# EAGLE design Ganganzeige_nutzen (EAGLE 6.5.0)

## Sheet 1 of 4
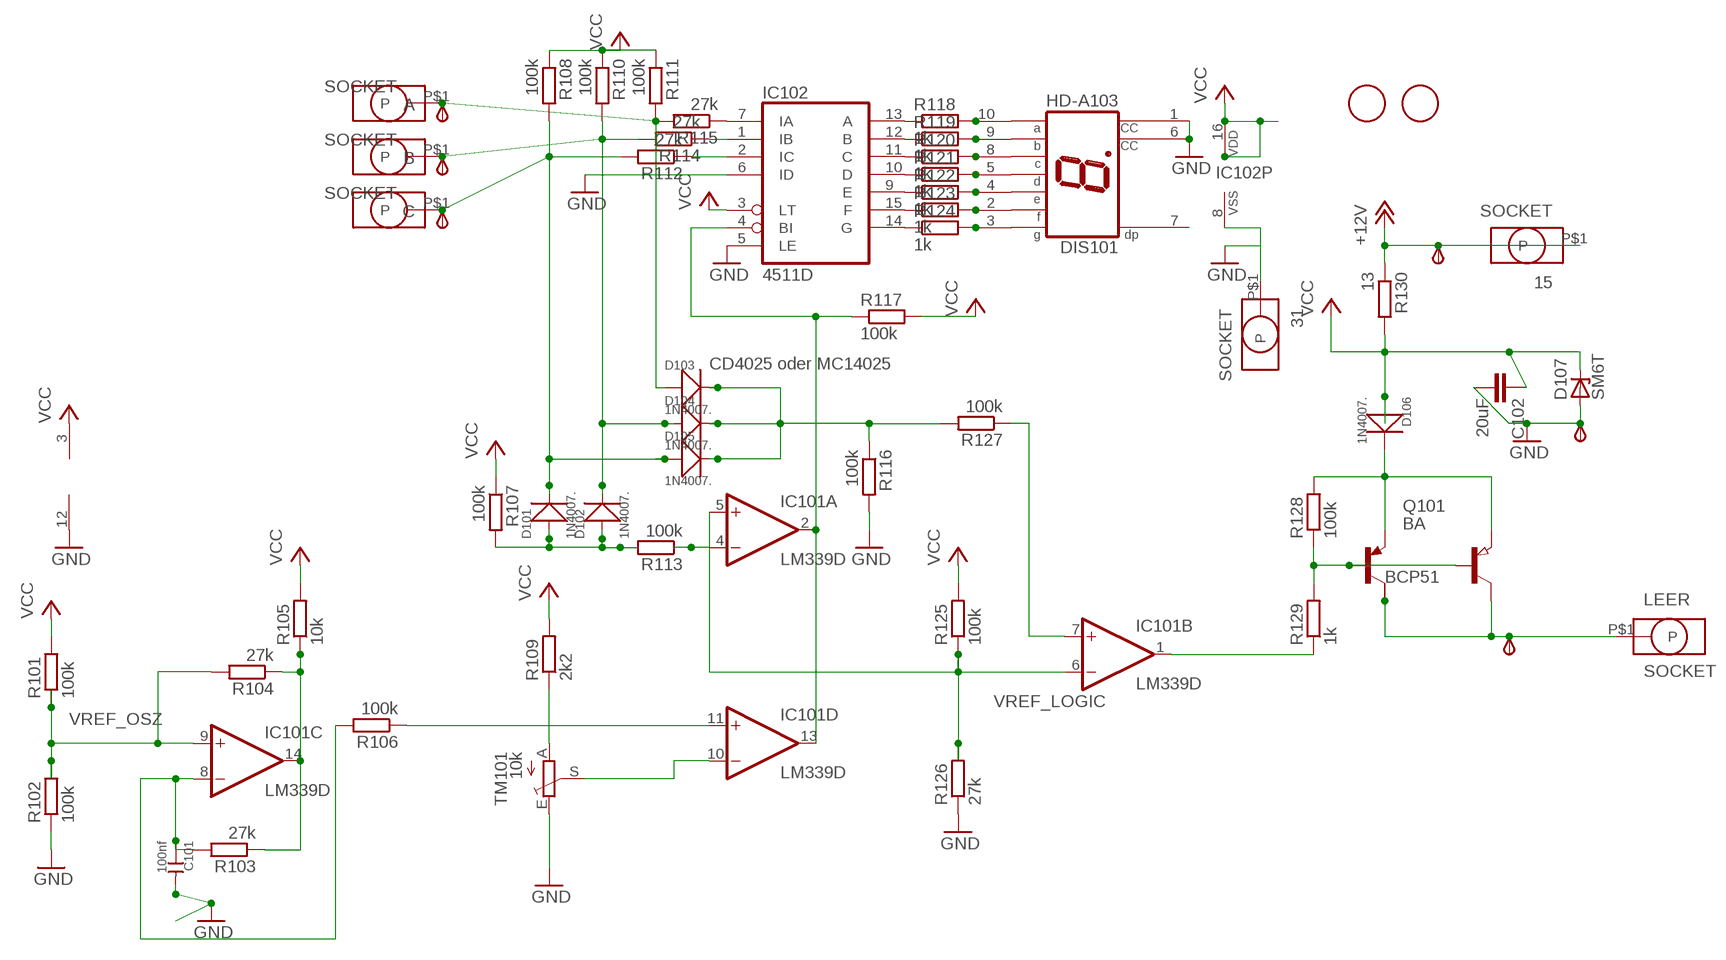
[diagram p0: schematic, sheet 1]

### Parts
15  SOCKET  [ID2.5MM]
15_  TPSB2.0  [B2.0]
31  SOCKET  [ID2.5MM]
A  SOCKET  [ID2.5MM]
A_  TPSB2.0  [B2.0]
B  SOCKET  [ID2.5MM]
B_  TPSB2.0  [B2.0]
C  SOCKET  [ID2.5MM]
C101  100nf  CERAMIC-100NF-50V-10%-X7R(0805)  [C0805]
C102  20uF  C-EUC1206K  [C1206K]
C_  TPSB2.0  [B2.0]
D101  1N4007.  DIODE-GEN-PURPOSE-1KV-1A(DO-214AC)  [DO-214AC]
D102  1N4007.  DIODE-GEN-PURPOSE-1KV-1A(DO-214AC)  [DO-214AC]
D103  1N4007.  DIODE-GEN-PURPOSE-1KV-1A(DO-214AC)  [DO-214AC]
D104  1N4007.  DIODE-GEN-PURPOSE-1KV-1A(DO-214AC)  [DO-214AC]
D105  1N4007.  DIODE-GEN-PURPOSE-1KV-1A(DO-214AC)  [DO-214AC]
D106  1N4007.  DIODE-GEN-PURPOSE-1KV-1A(DO-214AC)  [DO-214AC]
D107  SM6T  [DO214AA]
DIS101  HD-A103  [HDSP-A]
FID101  FIDUCIAL  [FIDUCIAL_1MM]
FID102  FIDUCIAL  [FIDUCIAL_1MM]
GND_  TPSB2.0  [B2.0]
IC101  LM339D  [SO14]
IC102  4511D  [SO16]
LEER  SOCKET  [ID2.5MM]
LEER_  TPSB2.0  [B2.0]
Q101  BA  PNP-TRANSISTOR_SOT89  [SOT89]
R101  100k  R-EU_R0805  [R0805]
R102  100k  R-EU_R0805  [R0805]
R103  27k  R-EU_R0805  [R0805]
R104  27k  R-EU_R0805  [R0805]
R105  10k  R-EU_R0805  [R0805]
R106  100k  R-EU_R0805  [R0805]
R107  100k  R-EU_R0805  [R0805]
R108  100k  R-EU_R0805  [R0805]
R109  2k2  R-EU_R0805  [R0805]
R110  100k  R-EU_R0805  [R0805]
R111  100k  R-EU_R0805  [R0805]
R112  27k  R-EU_R0805  [R0805]
R113  100k  R-EU_R0805  [R0805]
R114  27k  R-EU_R0805  [R0805]
R115  27k  R-EU_R0805  [R0805]
R116  100k  R-EU_R0805  [R0805]
R117  100k  R-EU_R0805  [R0805]
R118  1k  R-EU_R0805  [R0805]
R119  1k  R-EU_R0805  [R0805]
R120  1k  R-EU_R0805  [R0805]
R121  1k  R-EU_R0805  [R0805]
R122  1k  R-EU_R0805  [R0805]
R123  1k  R-EU_R0805  [R0805]
R124  1k  R-EU_R0805  [R0805]
R125  100k  R-EU_R0805  [R0805]
R126  27k  R-EU_R0805  [R0805]
R127  100k  R-EU_R0805  [R0805]
R128  100k  R-EU_R0805  [R0805]
R129  1k  R-EU_R0805  [R0805]
R130  13  R-EU_R1206  [R1206]
T  BCP53T1  [SOT223]
TM101  10k  TRIM_EU-S63X  [S63X]

### Nets
+12V: 15.P$1(P) 15_.TP(PP) R130.1 ; also sheet 2,3
GND: 31.P$1(P) C101.2 C102.2 D107.A DIS101.1(CC) DIS101.6(CC) GND_.TP(PP) IC101.12(P:GND) IC102.5(LE) IC102.6(ID) IC102.8(VSS) R102.1 R116.2 R126.1 TM101.E ; also sheet 2,3,4
N$1: IC102.13(A) R118.1
N$2: DIS101.10(A) R118.2
N$3: IC102.12(B) R119.1 ; also sheet 3
N$4: DIS101.9(B) R119.2
N$5: IC102.11(C) R120.1
N$6: DIS101.8(C) R120.2
N$7: IC102.10(D) R121.1
N$8: DIS101.5(D) R121.2
N$9: IC102.9(E) R122.1
N$10: R109.1 TM101.A
N$11: DIS101.4(E) R122.2
N$12: IC102.15(F) R123.1
N$13: DIS101.2(F) R123.2
N$14: IC102.14(G) R124.1
N$15: DIS101.3(G) R124.2
N$16: A.P$1(P) A_.TP(PP) D103.1(+) R111.2 R115.2
N$17: B.P$1(P) B_.TP(PP) D102.2(-) D104.1(+) R110.2 R114.2
N$18: C.P$1(P) C_.TP(PP) D101.2(-) D105.1(+) R108.2 R112.2
N$21: IC101.1(B:OUT) R129.1
N$22: Q101.1(B) R128.1 R129.2 T.1(B)
N$25: C101.1 IC101.8(C:-IN) R103.2 R106.2
N$26: IC101.14(C:OUT) R103.1 R104.1 R105.1
N$27: D101.1(+) D102.1(+) R107.2 R113.2
N$28: IC101.2(A:OUT) IC101.13(D:OUT) IC102.4(BI) R117.1
N$29: IC101.11(D:+IN) R106.1
N$30: IC101.10(D:-IN) TM101.S
N$32: IC101.7(B:+IN) R127.1
N$33: IC101.4(A:-IN) R113.1
N$34: IC102.7(IA) R115.1
N$35: D103.2(-) D104.2(-) D105.2(-) R116.1 R127.2
N$36: IC102.2(IC) R112.1
N$37: IC102.1(IB) R114.1
VCC [VCC]: C102.1 D106.1(+) D107.C IC101.3(P:V+) IC102.3(LT) IC102.16(VDD) R101.2 R105.2 R107.1 R108.1 R109.2 R110.1 R111.1 R117.2 R125.2 R130.2 ; also sheet 2,3
VREF_LOGIC: IC101.5(A:+IN) IC101.6(B:-IN) R125.1 R126.2 ; also sheet 2
VREF_OSZ: IC101.9(C:+IN) R101.1 R102.2 R104.2 ; also sheet 2
ZUEND_EIN [Zuendplus]: D106.2(-) Q101.3(E) R128.2 T.3(E)
ZUENDPLUS_OUT [Zuendplus]: LEER.P$1(P) LEER_.TP(PP) Q101.2(C) T.2(C)
Unconnected: DIS101.7(DP) T.4(C/)

### Notes on the sheet
- CD4025 oder MC14025

## Sheet 2 of 4
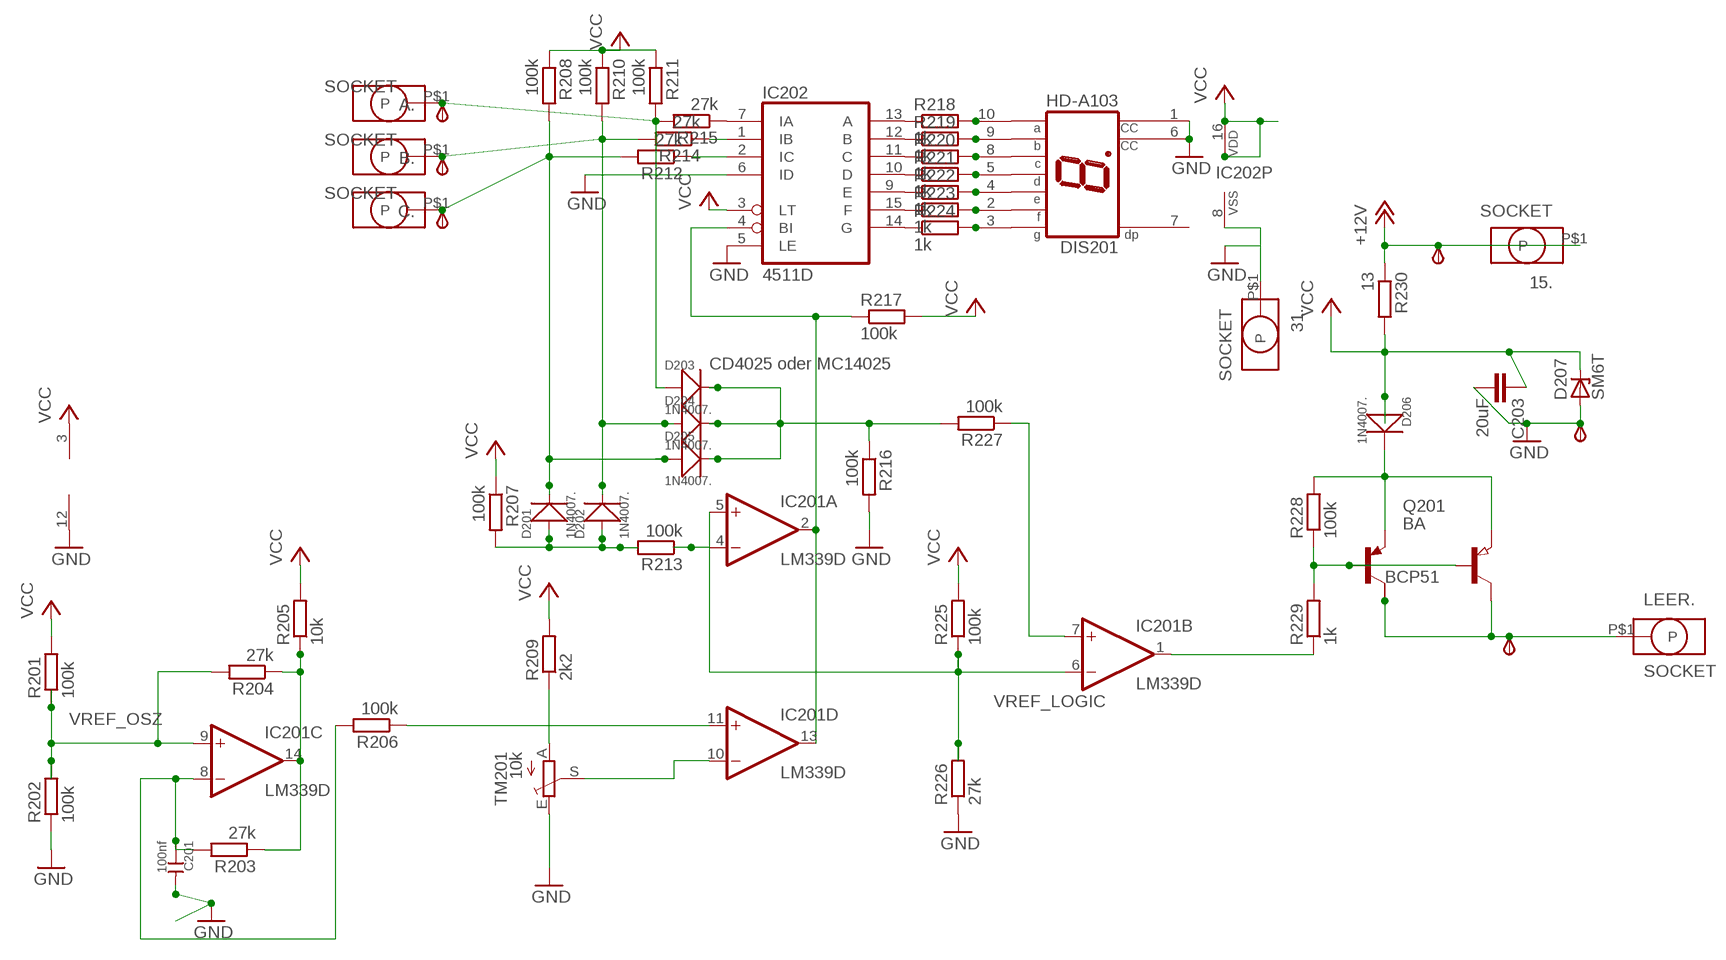
[diagram p1: schematic, sheet 2]

### Parts
15.  SOCKET  [ID2.5MM]
15_201  TPSB2.0  [B2.0]
31.  SOCKET  [ID2.5MM]
A.  SOCKET  [ID2.5MM]
A_201  TPSB2.0  [B2.0]
B.  SOCKET  [ID2.5MM]
B_201  TPSB2.0  [B2.0]
C201  100nf  CERAMIC-100NF-50V-10%-X7R(0805)  [C0805]
C203  20uF  C-EUC1206K  [C1206K]
C.  SOCKET  [ID2.5MM]
C_201  TPSB2.0  [B2.0]
D201  1N4007.  DIODE-GEN-PURPOSE-1KV-1A(DO-214AC)  [DO-214AC]
D202  1N4007.  DIODE-GEN-PURPOSE-1KV-1A(DO-214AC)  [DO-214AC]
D203  1N4007.  DIODE-GEN-PURPOSE-1KV-1A(DO-214AC)  [DO-214AC]
D204  1N4007.  DIODE-GEN-PURPOSE-1KV-1A(DO-214AC)  [DO-214AC]
D205  1N4007.  DIODE-GEN-PURPOSE-1KV-1A(DO-214AC)  [DO-214AC]
D206  1N4007.  DIODE-GEN-PURPOSE-1KV-1A(DO-214AC)  [DO-214AC]
D207  SM6T  [DO214AA]
DIS201  HD-A103  [HDSP-A]
GND_201  TPSB2.0  [B2.0]
IC201  LM339D  [SO14]
IC202  4511D  [SO16]
LEER.  SOCKET  [ID2.5MM]
LEER_201  TPSB2.0  [B2.0]
Q201  BA  PNP-TRANSISTOR_SOT89  [SOT89]
R201  100k  R-EU_R0805  [R0805]
R202  100k  R-EU_R0805  [R0805]
R203  27k  R-EU_R0805  [R0805]
R204  27k  R-EU_R0805  [R0805]
R205  10k  R-EU_R0805  [R0805]
R206  100k  R-EU_R0805  [R0805]
R207  100k  R-EU_R0805  [R0805]
R208  100k  R-EU_R0805  [R0805]
R209  2k2  R-EU_R0805  [R0805]
R210  100k  R-EU_R0805  [R0805]
R211  100k  R-EU_R0805  [R0805]
R212  27k  R-EU_R0805  [R0805]
R213  100k  R-EU_R0805  [R0805]
R214  27k  R-EU_R0805  [R0805]
R215  27k  R-EU_R0805  [R0805]
R216  100k  R-EU_R0805  [R0805]
R217  100k  R-EU_R0805  [R0805]
R218  1k  R-EU_R0805  [R0805]
R219  1k  R-EU_R0805  [R0805]
R220  1k  R-EU_R0805  [R0805]
R221  1k  R-EU_R0805  [R0805]
R222  1k  R-EU_R0805  [R0805]
R223  1k  R-EU_R0805  [R0805]
R224  1k  R-EU_R0805  [R0805]
R225  100k  R-EU_R0805  [R0805]
R226  27k  R-EU_R0805  [R0805]
R227  100k  R-EU_R0805  [R0805]
R228  100k  R-EU_R0805  [R0805]
R229  1k  R-EU_R0805  [R0805]
R230  13  R-EU_R1206  [R1206]
T201  BCP53T1  [SOT223]
TM201  10k  TRIM_EU-S63X  [S63X]

### Nets
+12V: 15..P$1(P) 15_201.TP(PP) R230.1 ; also sheet 1,3
GND: 31..P$1(P) C201.2 C203.2 D207.A DIS201.1(CC) DIS201.6(CC) GND_201.TP(PP) IC201.12(P:GND) IC202.5(LE) IC202.6(ID) IC202.8(VSS) R202.1 R216.2 R226.1 TM201.E ; also sheet 1,3,4
N$19: IC202.13(A) R218.1
N$23: DIS201.10(A) R218.2
N$24: IC202.12(B) R219.1
N$31: DIS201.9(B) R219.2
N$38: IC202.11(C) R220.1
N$39: DIS201.8(C) R220.2
N$40: IC202.10(D) R221.1
N$41: DIS201.5(D) R221.2
N$42: IC202.9(E) R222.1
N$43: DIS201.4(E) R222.2
N$44: IC202.15(F) R223.1
N$45: DIS201.2(F) R223.2
N$46: IC202.14(G) R224.1
N$47: DIS201.3(G) R224.2
N$48: A..P$1(P) A_201.TP(PP) D203.1(+) R211.2 R215.2
N$49: B..P$1(P) B_201.TP(PP) D202.2(-) D204.1(+) R210.2 R214.2
N$50: C..P$1(P) C_201.TP(PP) D201.2(-) D205.1(+) R208.2 R212.2
N$52: IC201.1(B:OUT) R229.1
N$53: Q201.1(B) R228.1 R229.2 T201.1(B)
N$54: D201.1(+) D202.1(+) R207.2 R213.2
N$55: IC201.2(A:OUT) IC201.13(D:OUT) IC202.4(BI) R217.1
N$56: D203.2(-) D204.2(-) D205.2(-) R216.1 R227.2
N$57: C201.1 IC201.8(C:-IN) R203.2 R206.2
N$58: IC201.14(C:OUT) R203.1 R204.1 R205.1
N$59: IC201.10(D:-IN) TM201.S
N$60: IC201.11(D:+IN) R206.1
N$61: IC201.7(B:+IN) R227.1
N$62: IC201.4(A:-IN) R213.1
N$63: IC202.7(IA) R215.1
N$64: IC202.2(IC) R212.1
N$65: IC202.1(IB) R214.1
N$66: R209.1 TM201.A
VCC [VCC]: C203.1 D206.1(+) D207.C IC201.3(P:V+) IC202.3(LT) IC202.16(VDD) R201.2 R205.2 R207.1 R208.1 R209.2 R210.1 R211.1 R217.2 R225.2 R230.2 ; also sheet 1,3
VREF_LOGIC: IC201.5(A:+IN) IC201.6(B:-IN) R225.1 R226.2 ; also sheet 1
VREF_OSZ: IC201.9(C:+IN) R201.1 R202.2 R204.2 ; also sheet 1
ZUEND_EIN1 [Zuendplus]: D206.2(-) Q201.3(E) R228.2 T201.3(E)
ZUENDPLUS_OUT1 [Zuendplus]: LEER..P$1(P) LEER_201.TP(PP) Q201.2(C) T201.2(C)
Unconnected: DIS201.7(DP) T201.4(C/)

### Notes on the sheet
- CD4025 oder MC14025

## Sheet 3 of 4
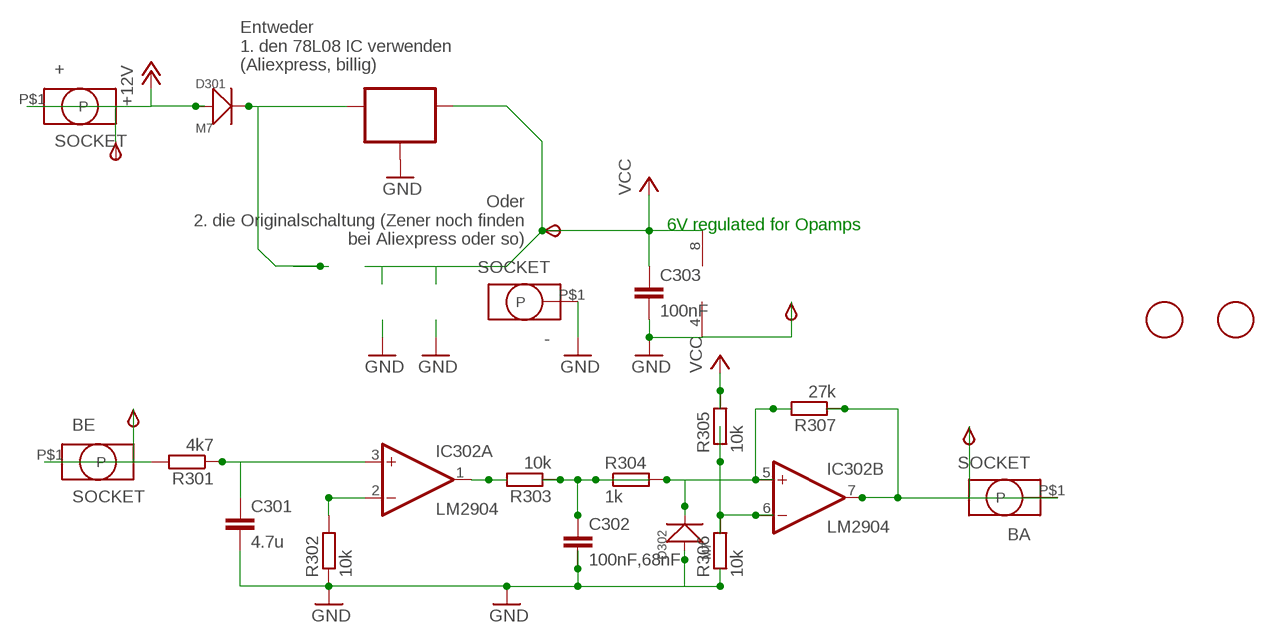
[diagram p2: schematic, sheet 3]

### Parts
6V  TPSB2.0  [B2.0]
+  SOCKET  [ID2.5MM]
+12V  TPSB2.0  [B2.0]
-  SOCKET  [ID2.5MM]
AUS  TPSB2.0  [B2.0]
BA  SOCKET  [ID2.5MM]
BE  SOCKET  [ID2.5MM]
C301  4.7u  C-EUC0805K  [C0805K]
C302  100nF,68nF  C-EUC0805K  [C0805K]
C303  100nF  C-EUC0805K  [C0805K]
D301  M7  DIODE-GEN-PURPOSE-1KV-1A(DO-214AC)  [DO-214AC]
D302  M7  DIODE-GEN-PURPOSE-1KV-1A(DO-214AC)  [DO-214AC]
EIN  TPSB2.0  [B2.0]
FID301  FIDUCIAL  [FIDUCIAL_1MM]
FID302  FIDUCIAL  [FIDUCIAL_1MM]
GND  TPSB2.0  [B2.0]
IC301  5V/6V oder 8V Regler  78LXXSOT89_ROUND  [SOT89_ROUND]
IC302  LM2904  LM358D  [SO08]
R301  4k7  R-EU_R0805  [R0805]
R302  10k  R-EU_R0805  [R0805]
R303  10k  R-EU_R0805  [R0805]
R304  1k  R-EU_R0805  [R0805]
R305  10k  R-EU_R0805  [R0805]
R306  10k  R-EU_R0805  [R0805]
R307  27k  R-EU_R0805  [R0805]

### Nets
+12V: +12V.TP(PP) +.P$1(P) D301.1(+) ; also sheet 1,2
+12V1: AUS.TP(PP) BA.P$1(P) IC302.7(B:OUT) R307.1
GND: -.P$1(P) C301.2 C302.2 C303.2 D302.1(+) GND.TP(PP) IC301.2(GND) IC301.2@1(GND) IC302.4(P:V-) R302.1 R306.1 ; also sheet 1,2,4
N$67: IC302.2(A:-IN) R302.2
N$68: BE.P$1(P) EIN.TP(PP) R301.2
N$69: C301.1 IC302.3(A:+IN) R301.1
N$70: D301.2(-) IC301.3(IN)
N$92: IC302.1(A:OUT) R303.2
N$96: C302.1 R303.1 R304.1
N$97: D302.2(-) IC302.5(B:+IN) R304.2 R307.2
N$101: IC302.6(B:-IN) R305.1 R306.2
VCC [VCC]: 6V.TP(PP) C303.1 IC301.1(OUT) IC302.8(P:V+) R305.2 ; also sheet 1,2

### Notes on the sheet
- Entweder
  1. den 78L08 IC verwenden 
  (Aliexpress, billig)
- Oder
  2. die Originalschaltung (Zener noch finden
  bei Aliexpress oder so)
- 6V regulated for Opamps

## Sheet 4 of 4
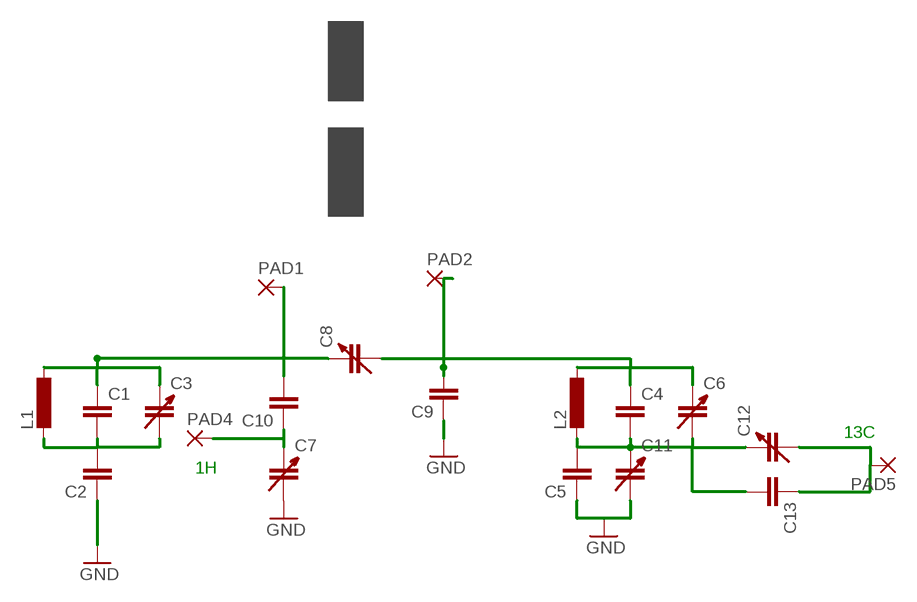
[diagram p3: schematic, sheet 4]

### Parts
C1  C-EUC055X055_HIGH_DENSITY  [C055X055_HD]
C2  C-EUC055X055_HIGH_DENSITY  [C055X055_HD]
C3  CTRIM-EUVOLTRONICS_JZ_SERIES  [VOLTRONICS_JZ]
C4  C-EUC055X055_HIGH_DENSITY  [C055X055_HD]
C5  C-EUC055X055_HIGH_DENSITY  [C055X055_HD]
C6  CTRIM-EUVOLTRONICS_JZ_SERIES  [VOLTRONICS_JZ]
C7  CTRIM-EUVOLTRONICS_JZ_SERIES  [VOLTRONICS_JZ]
C8  CTRIM-EUVOLTRONICS_JZ_SERIES  [VOLTRONICS_JZ]
C9  C-EUC055X055_HIGH_DENSITY  [C055X055_HD]
C10  C-EUC055X055_HIGH_DENSITY  [C055X055_HD]
C11  CTRIM-EUVOLTRONICS_JZ_SERIES  [VOLTRONICS_JZ]
C12  CTRIM-EUVOLTRONICS_JZ_SERIES  [VOLTRONICS_JZ]
C13  C-EUC055X055_HIGH_DENSITY  [C055X055_HD]
L1  L-EU6WDG_0.5MM_SELFWOUND_COIL  [6WDG_0.5MM]
L2  L-EU6WDG_0.5MM_SELFWOUND_COIL  [6WDG_0.5MM]
PAD1  SMD2  [SMD1,27-2,54]
PAD2  SMD2  [SMD1,27-2,54]
PAD4  1,6/0,9  [1,6/0,9]
PAD5  1,6/0,9  [1,6/0,9]

### Nets
GND: C2.1 C5.1 C7.2 C9.1 C11.2 ; also sheet 1,2,3
N$76: C1.2 C2.2 C3.2 L1.2
N$77: C4.2 C5.2 C6.2 C11.1 C12.1 C13.2 L2.2
N$78: C4.1 C6.1 C8.2 C9.2 L2.1 PAD2.1(P)
N$79: C7.1 C10.1 PAD4.1(P)
N$80: C1.1 C3.1 C8.1 C10.2 L1.1 PAD1.1(P)
N$81: C12.2 C13.1 PAD5.1(P)

### Notes on the sheet
- 13C
- 1H

## Library data of the parts
6V 15_ 15_201 +12V A_ A_201 AUS B_ B_201 C_ C_201 EIN GND GND_ GND_201 LEER_ LEER_201 = testpin_BMW:TPS: TEST PIN
15 15. 31 31. + - A A. B B. BA BE C C. LEER LEER. = Brotbox_Socket_Header:SOCKET
C1 C2 C4 C5 C9 C10 C13 = F80_project_library:C-EU: CAPACITOR, European symbol
C3 C6-C8 C11 C12 = F80_project_library:CTRIM-EU: Trimmer Capacitors
C101 C201 = Seeed-Capacitor-2016:CERAMIC-100NF-50V-10%-X7R(0805): 302010165; MPN: CC0805KRX7R9BB104
C102 C203 C301-C303 = rcl:C-EU: CAPACITOR, European symbol
D101-D106 D201-D206 D301 D302 = Diode-do214ac:DIODE-GEN-PURPOSE-1KV-1A(DO-214AC): 304010013; MPN: 1N4007; VALUE: 1N4007
D107 D207 = Suppressor_Diode_DO214AA:SM6T: Z DIODE
DIS101 DIS201 = display-hp:HD-A103: LED DISPLAY 1-character 7 segment, decimal point right; OC_FARNELL: unknown; OC_NEWARK: unknown
FID101 FID102 FID301 FID302 = Fiducial:FIDUCIAL: For use by pick and place machines to calibrate the vision/machine, 1mm By microbuilder.eu
IC101 IC201 = LM339:LM339: Low Power Low Offset Voltage Quad Comparators with open collector; LM139/LM239/LM339/LM2901/LM3302
IC102 IC202 = 45xx:4511: BCD to 7-segment LATCH/DECODER/DRIVER
IC301 = 78LXX:78LXX
IC302 = linear_BMW:LM358: OP AMP also LM158; LM258; LM2904 Source: http://cache.national.com/ds/LM/LM158.pdf
L1 L2 = F80_project_library:L-EU: INDUCTOR, European symbol
PAD1 PAD2 = wirepad:SMD2: SMD PAD
PAD4 PAD5 = wirepad:1,6/0,9: THROUGH-HOLE PAD
Q101 Q201 = Transistor_SOT89:PNP-TRANSISTOR_: PNP TRANSISTOR
R101-R130 R201-R230 R301-R307 = rcl:R-EU_: RESISTOR, European symbol
T T201 = BCP53_:BCP53*; T: BCP51
TM101 TM201 = pot:TRIM_EU-: POTENTIOMETER

## Net classes
1 VCC: width 0.6 mm
2 Zuendplus: width 1 mm, drill 0.6 mm

## Board
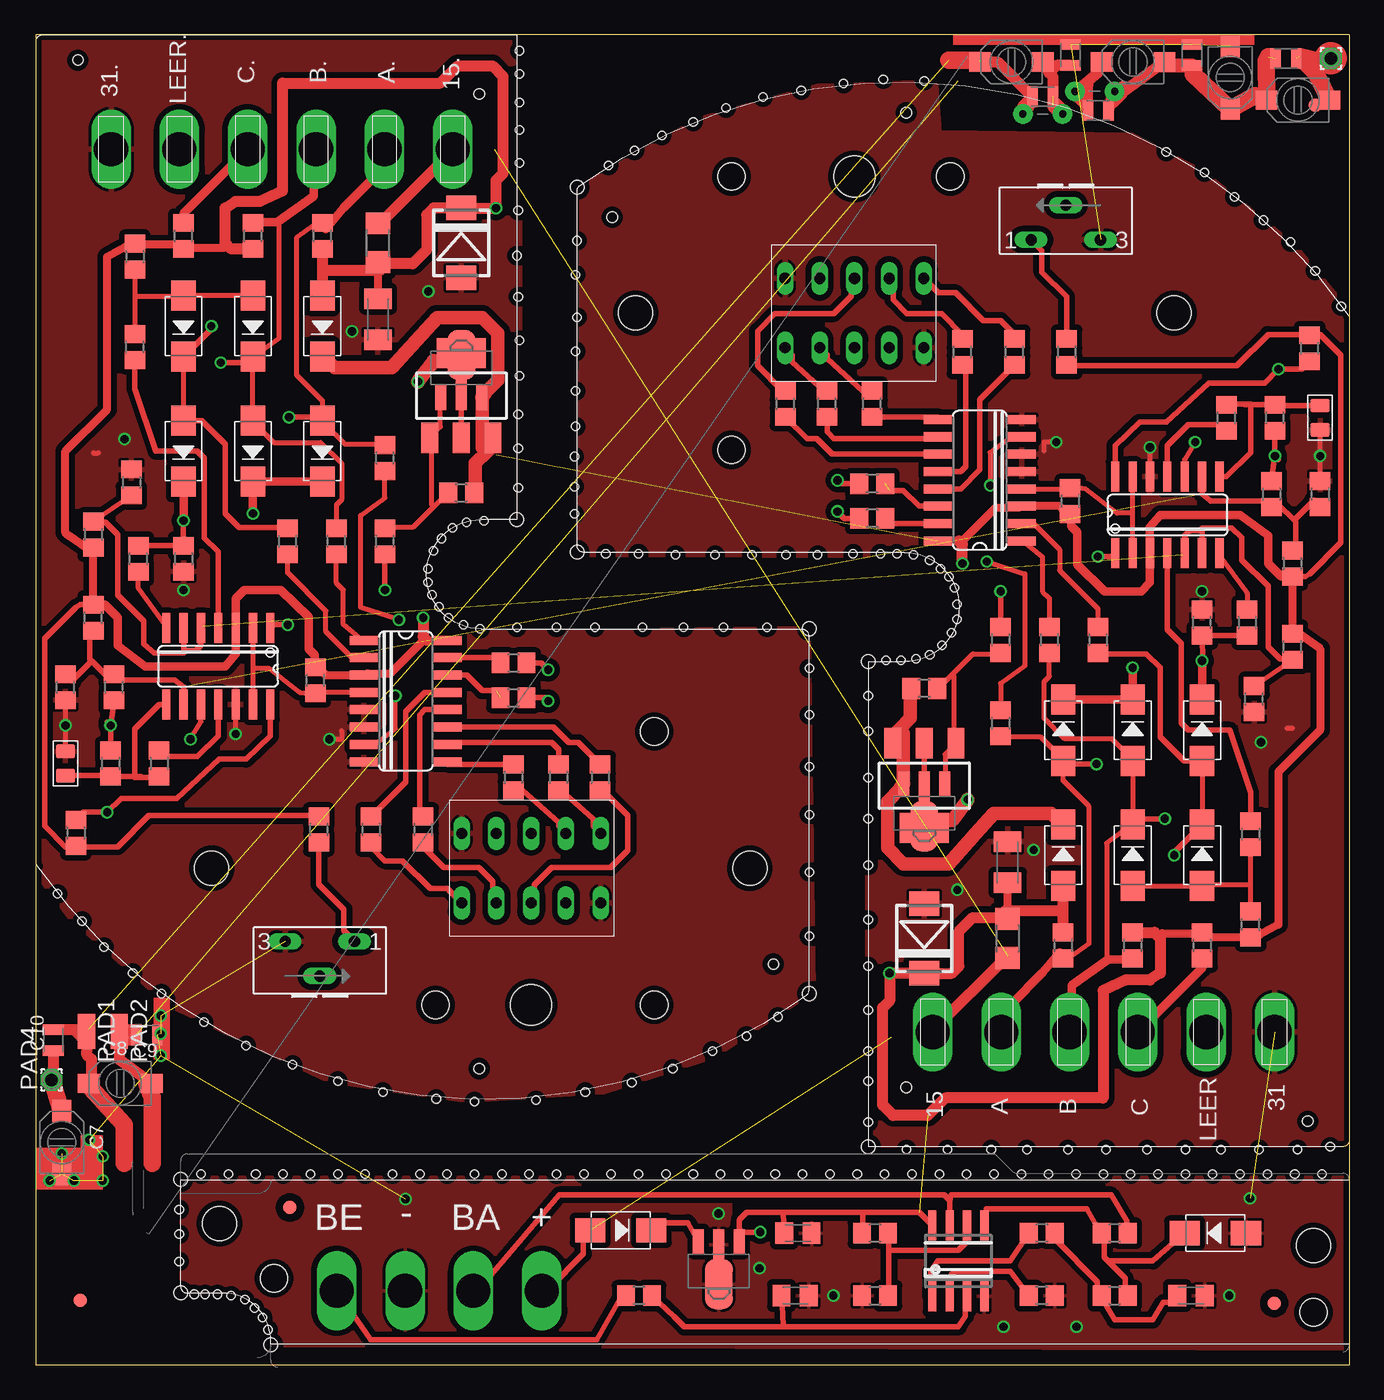
[diagram p4: board, top side]
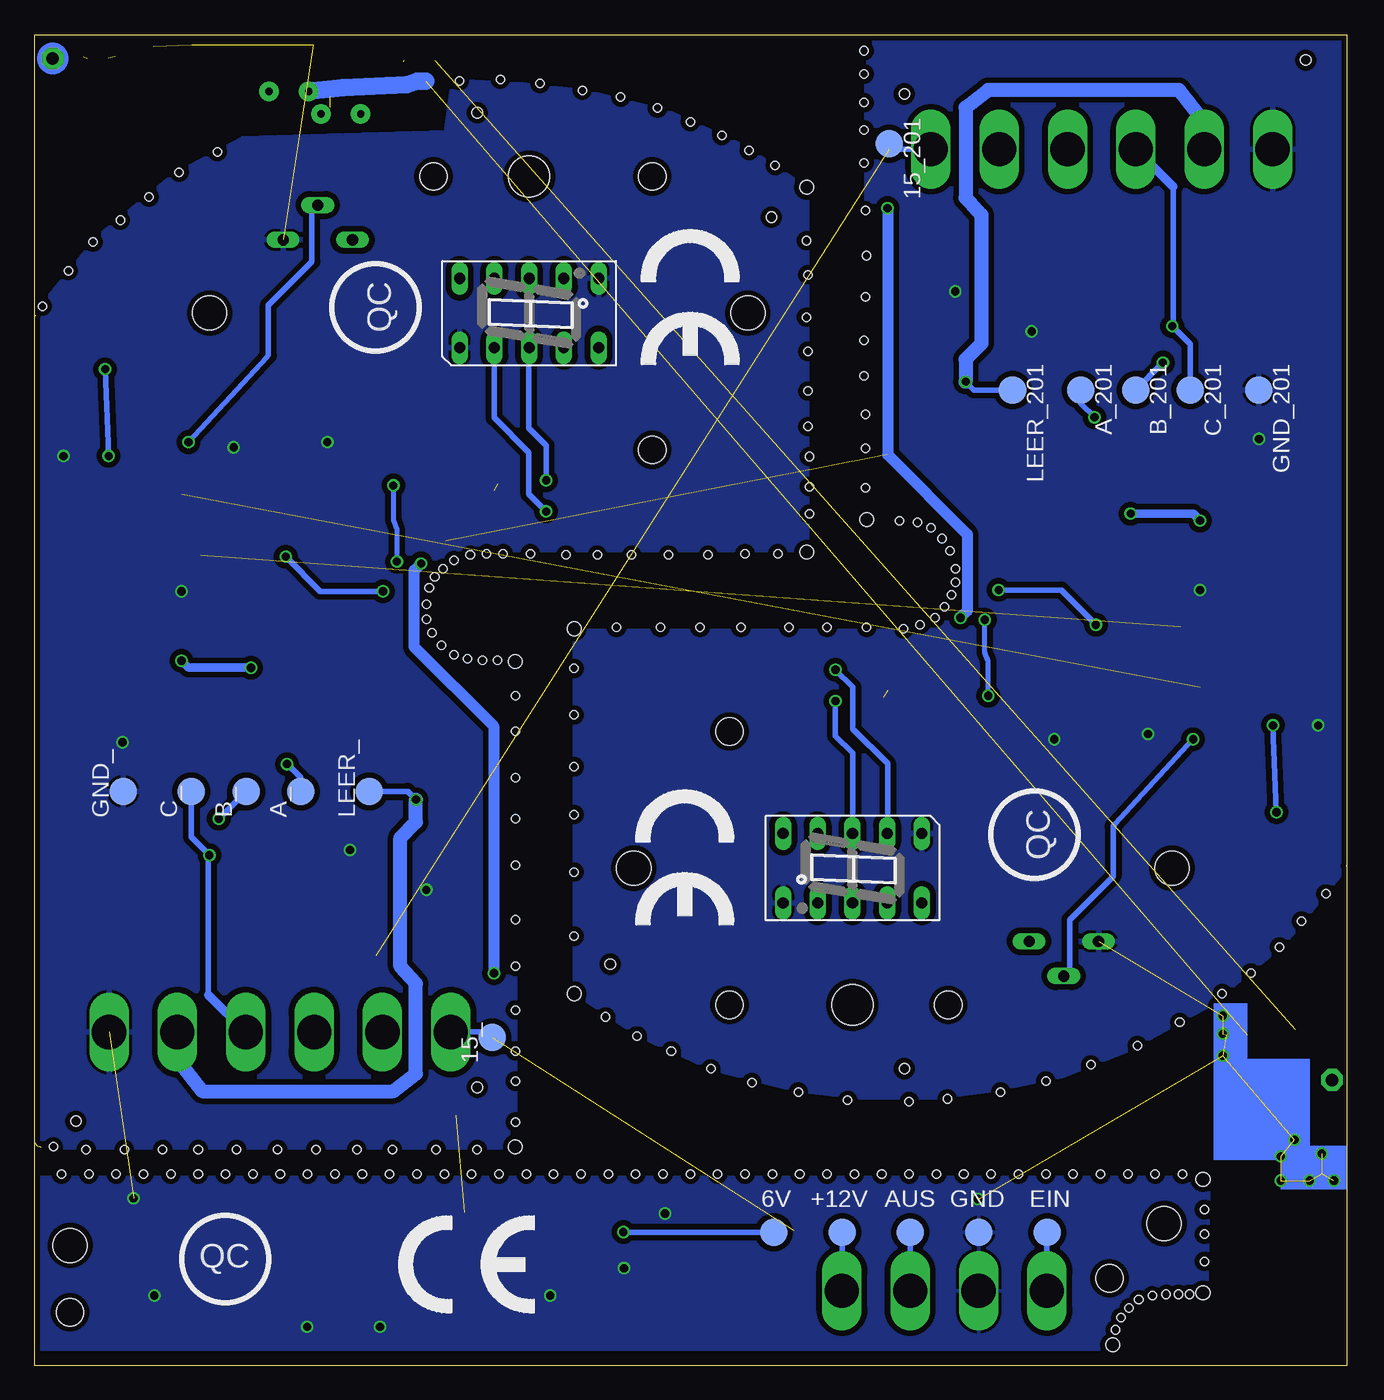
[diagram p5: board, bottom side, seen from below]

Size 96.06 x 97.38 mm. Coordinates in mm from the lower left corner, seen from the top.
Outline: 95.97,76.85 arc-35 96.06,76.56
Outline: 96.06,16.5 96.06,97.38 0,97.38 0,0 96.06,0 96.06,16.5
Outline: 96.06,16.5 arc-90 95.56,16
Outline: 0.09,36.53 arc-35 0,36.81
Outline: 96.06,13.56 96.06,1.55
Copper layers (1*16): Top 0.035mm / dielectric 1.5mm / Bottom 0.035mm
Design rules "Ganganzeige2b *": minimum track width 15mil, minimum drill 12mil, track to track 0.41mm, track to pad 12mil, pad to pad 0.205mm, via to via 0.205mm, smd to smd 6mil, copper to edge 0.4mm, drill to drill 8mil, minimum pad ring 8mil, minimum via ring 6mil, stop-mask expansion 3mil, vias tented up to drill 0mil, thermal gap 8mil
Holes 0.75 mm at 63.65,91.66 42.14,84.02 93.02,17.86 63.65,20.34 32.41,21.72 53.93,29.36 3.05,95.51 32.41,93.04
Holes 2.5 mm at 43.86,77 83.23,77 52.21,36.38 12.84,36.38 13.41,10.38 93.44,8.78
Holes 3 mm at 59.86,87 36.21,26.38
Holes 2 mm at 50.86,87 66.86,87 50.86,67 45.21,26.38 29.21,26.38 45.21,46.38 17.4,6.37 93.44,3.88
Holes 1 mm at 35.16,61.9 60.86,51.5 56.56,53.9 39.56,59.5 10.56,13.6 17.16,1.5 10.56,5.3 60.86,16 56.56,27.2 39.56,86.2
Holes 0.6 mm at 32.76,61.8 31.46,61.7 30.46,61.3 29.66,60.5 29.06,59.6 28.66,58.3 28.66,57.3 28.96,56.4 29.46,55.5 30.16,54.7 31.26,54.2 32.46,53.9 62.16,51.6 63.26,51.6 64.36,51.7 65.36,52 66.26,52.7 66.96,53.6 67.36,54.6 67.36,55.7 67.16,56.9 66.76,57.7 66.16,58.3 65.36,58.9 64.16,59.3 62.96,59.4 16.96,2.6 16.56,3.5 15.96,4.2 15.26,4.8 14.26,5.1 13.26,5.2 12.36,5.2 11.56,5.2 32.06,19.3 36.56,19.4 40.16,20 43.56,20.7 46.56,21.7 49.46,23 51.96,24.1 54.26,25.5 29.26,19.5 25.36,20 22.06,20.8 18.76,22 15.36,23.4 12.26,25.1 9.16,27.2 7.06,28.7 4.96,30.6 3.36,32.5 1.56,34.5 56.56,31.4 56.56,36.1 56.56,40.3 56.56,43.8 56.56,47.6 56.56,51 53.46,54 50.26,54 47.36,54 44.36,54 40.86,54 38.06,54 35.16,54 41.86,87.8 43.76,88.9 45.76,90 48.06,91 50.46,92 53.16,92.8 55.96,93.3 59.06,93.8 61.96,94.1 64.96,94 82.66,88.8 85.46,87.3 87.66,85.5 89.76,83.8 91.76,82.2 93.56,80.1 95.46,77.5 39.56,82.3 35.36,88 35.26,84.5 35.16,81.2 35.26,78.2 35.36,75 39.46,79.8 39.56,76.7 39.46,74.2 39.46,71.3 39.46,68.7 39.36,66.5 39.36,64.3 39.36,62.3 35.26,64.2 35.26,67.1 35.26,69.6 35.36,72.4 41.66,59.4 44.06,59.4 46.76,59.3 49.66,59.3 52.36,59.3 54.86,59.3 57.16,59.3 59.76,59.4 61.76,59.4 35.36,90.4 35.36,92.4 35.36,94.5 35.36,96.2 60.86,49 60.86,46.4 60.86,43 60.86,40 60.86,36.6 60.86,32.6 60.86,29.2 60.86,26 60.86,23 60.86,20.8 60.86,17.8 63.66,15.8 66.66,15.8 69.86,15.8 72.46,15.8 75.46,15.8 78.26,15.8 81.26,15.8 84.06,15.8 86.66,15.8 89.46,15.8 92.26,15.8 94.66,16 10.46,11.4 10.46,9.6 10.46,7.6 94.06,14 92.06,14 90.06,14 88.06,14 86.06,14 84.06,14 82.06,14 80.06,14 78.06,14 76.06,14 74.06,14 72.06,14 70.06,14 68.06,14 66.06,14 64.06,14 62.06,14 60.06,14 58.06,14 56.06,14 54.06,14 52.06,14 50.06,14 48.06,14 46.06,14 44.06,14 42.06,14 40.06,14 38.06,14 36.06,14 34.06,14 32.06,14 30.06,14 28.06,14 26.06,14 24.06,14 22.06,14 20.06,14 18.06,14 16.06,14 14.06,14 12.06,14
tRestrict: area 51,11.2 to 66.4,12

### Footprints (pad centres in the part's own frame; a part is rotated, then mirrored left to right if it is on the bottom)
B2.0 = smd 2 x 2: TP 0,0
ID2.5MM = drill 2.5 long: P$1 0,0
C055X055_HD = smd 0.762 x 1.524: 1 -0.762,0; 2 0.762,0
VOLTRONICS_JZ = smd 1.6 x 1.4: 1 -2.3,0; 2 2.3,0
C0805 = smd 1.397 x 1.016: 1 0,0.889; 2 0,-0.889
C1206K = smd 1.5 x 2: 1 -1.5,0; 2 1.5,0
C0805K = smd 1.3 x 1.6: 1 -1,0; 2 1,0
DO-214AC = smd 2.2 x 1.77: 1 -2.242,0; 2 2.242,0
DO214AA = smd 1.8 x 2.2: A 2.55,0; C -2.55,0
HDSP-A = drill 0.813 long: 1 -2.54,5.08; 2 -2.54,2.54; 3 -2.54,0; 4 -2.54,-2.54; 5 -2.54,-5.08; 6 2.54,-5.08; 7 2.54,-2.54; 8 2.54,0; 9 2.54,2.54; 10 2.54,5.08
FIDUCIAL_1MM = smd 1 x 1: 1 0,0
SO14 = smd 0.6 x 2.2: 1 -3.81,-2.8; 2 -2.54,-2.8; 3 -1.27,-2.8; 4 0,-2.8; 5 1.27,-2.8; 6 2.54,-2.8; 7 3.81,-2.8; 8 3.81,2.8; 9 2.54,2.8; 10 1.27,2.8; 11 0,2.8; 12 -1.27,2.8; 13 -2.54,2.8; 14 -3.81,2.8
SO16 = smd 0.66 x 2.032: 1 -4.445,-3.073; 2 -3.175,-3.073; 3 -1.905,-3.073; 4 -0.635,-3.073; 5 0.635,-3.073; 6 1.905,-3.073; 7 3.175,-3.073; 8 4.445,-3.073; 9 4.445,3.073; 10 3.175,3.073; 11 1.905,3.073; 12 0.635,3.073; 13 -0.635,3.073; 14 -1.905,3.073; 15 -3.175,3.073; 16 -4.445,3.073
SOT89_ROUND = smd 0.8 x 1.8: 1 -1.499,-2.181; 3 1.499,-2.181 | smd 0.8 x 2.3: 2 0,-1.927 | smd 2.032 x 3.65: 2@1 0,0.94
SO08 = smd 0.6 x 2.2: 1 -1.905,-2.6; 2 -0.635,-2.6; 3 0.635,-2.6; 4 1.905,-2.6; 5 1.905,2.6; 6 0.635,2.6; 7 -0.635,2.6; 8 -1.905,2.6
6WDG_0.5MM = drill 0.52 pad 1.422: 1 -1.45,0; 2 1.45,0
SMD1,27-2,54 = smd 1.27 x 2.54: 1 0,0
1,6/0,9 = drill 0.914 pad 1.6 octagon: 1 0,0
SOT89 = smd 0.8 x 1.8: 1 -1.499,-2.181; 3 1.499,-2.181 | smd 0.8 x 2.3: 2 0,-1.927 | smd 2.032 x 3.65: 2@1 0,0.94
R0805 = smd 1.3 x 1.5: 1 -0.95,0; 2 0.95,0
R1206 = smd 1.6 x 1.803: 1 -1.422,0; 2 1.422,0
SOT223 = smd 1.219 x 2.235: 1 -2.311,-3.099; 2 0,-3.099; 3 2.311,-3.099 | smd 3.6 x 2.2: 4 0,3.099
S63X = drill 0.813 long: A 2.54,0; E -2.54,0; S 0,-2.54

### Placement (x,y rotation side)
6V  41.96,9.75 0 bottom
15  65.59,24.39 270 top
15.  30.48,88.99 90 top
15_  62.56,24 90 bottom
15_201  33.5,89.38 270 bottom
31  90.59,24.39 270 top
31.  5.48,88.99 90 top
+  36.98,5.45 90 top
+12V  36.96,9.75 0 bottom
-  26.98,5.45 90 top
A  70.59,24.39 270 top
A.  25.48,88.99 90 top
A_  76.56,42 90 bottom
A_201  19.5,71.38 270 bottom
AUS  31.96,9.75 0 bottom
B  75.59,24.39 270 top
B.  20.48,88.99 90 top
B_  80.56,42 90 bottom
B_201  15.5,71.38 270 bottom
BA  31.98,5.45 90 top
BE  21.98,5.45 90 top
C  80.59,24.39 270 top
C1  73.63,92.84 0 top
C2  75.66,95.89 270 top
C3  71.34,95.38 0 top
C4  77.69,91.82 0 top
C5  84.55,95.89 270 top
C6  80.23,95.38 0 top
C7  1.87,16.31 270 top
C8  6.14,20.63 0 top
C9  8.1,24.19 180 top
C10  1.24,23.8 90 top
C11  87.35,94.23 90 top
C12  92.3,92.58 0 top
C13  91.41,95.63 180 top
C101  93.92,69.34 0 top
C102  71.06,36.83 90 top
C201  2.14,44.04 180 top
C203  25,76.55 270 top
C301  55.52,5.11 0 top
C302  84.48,5.11 0 top
C303  55.72,9.68 0 top
C.  15.48,88.99 90 top
C_  84.56,42 90 bottom
C_201  11.5,71.38 270 bottom
D101  85.28,37.34 90 top
D102  80.2,37.34 90 top
D103  75.12,46.48 90 top
D104  80.2,46.48 90 top
D105  85.28,46.48 90 top
D106  75.12,37.34 90 top
D107  64.96,31.24 90 top
D201  10.78,76.04 270 top
D202  15.86,76.04 270 top
D203  20.94,66.9 270 top
D204  15.86,66.9 270 top
D205  10.78,66.9 270 top
D206  20.94,76.04 270 top
D207  31.1,82.14 270 top
D301  42.76,9.88 0 top
D302  86.26,9.68 180 top
DIS101  59.86,77 90 bottom
DIS201  36.21,36.38 270 bottom
EIN  21.96,9.75 0 bottom
FID101  93.58,92.19 270 top
FID102  3.22,4.75 270 top
FID301  90.56,4.55 0 top
FID302  18.56,11.55 0 top
GND  26.96,9.75 0 bottom
GND_  89.56,42 90 bottom
GND_201  6.5,71.38 270 bottom
IC101  82.74,62.23 0 top
IC102  69.03,64.77 90 top
IC201  13.32,51.15 180 top
IC202  27.04,48.61 270 top
IC301  49.93,6.88 180 top
IC302  67.46,7.65 0 top
L1  73.63,91.57 0 top
L2  77.44,93.22 0 top
LEER  85.59,24.39 270 top
LEER.  10.48,88.99 90 top
LEER_  71.56,42 90 bottom
LEER_201  24.5,71.38 270 bottom
PAD1  3.67,24.44 180 top
PAD2  6.07,24.44 180 top
PAD4  1.12,20.88 90 top
PAD5  94.71,95.63 180 top
Q101  64.96,40.38 180 top
Q201  31.1,72.99 0 top
R101  91.89,58.67 270 top
R102  93.92,63.75 270 top
R103  90.62,69.34 90 top
R104  90.36,63.75 270 top
R105  93.16,74.42 90 top
R106  87.06,69.34 90 top
R107  88.84,32.26 90 top
R108  85.28,30.73 270 top
R109  75.38,74.17 270 top
R110  80.2,30.73 270 top
R111  75.12,30.73 270 top
R112  77.66,53.08 270 top
R113  88.84,38.86 270 top
R114  74.11,53.08 270 top
R115  70.55,46.99 270 top
R116  85.28,54.35 90 top
R117  75.63,63.24 270 top
R118  71.57,74.17 90 top
R119  67.76,74.17 90 top
R120  54.8,70.36 90 top
R121  57.85,70.36 90 top
R122  61.15,70.36 90 top
R123  61.15,61.97 180 top
R124  61.15,64.51 180 top
R125  91.89,52.58 90 top
R126  89.09,48.77 90 top
R127  88.59,54.35 270 top
R128  64.96,49.53 180 top
R129  70.55,53.08 270 top
R130  71.06,31.24 90 top
R201  4.18,54.71 90 top
R202  2.14,49.63 90 top
R203  5.45,44.04 270 top
R204  5.7,49.63 90 top
R205  2.91,38.96 270 top
R206  9,44.04 270 top
R207  7.22,81.12 270 top
R208  10.78,82.65 90 top
R209  20.69,39.21 90 top
R210  15.86,82.65 90 top
R211  20.94,82.65 90 top
R212  18.4,60.29 90 top
R213  7.22,74.52 90 top
R214  21.96,60.29 90 top
R215  25.51,66.39 90 top
R216  10.78,59.02 270 top
R217  20.43,50.13 90 top
R218  24.5,39.21 270 top
R219  28.31,39.21 270 top
R220  41.26,43.02 270 top
R221  38.21,43.02 270 top
R222  34.91,43.02 270 top
R223  34.91,51.4 0 top
R224  34.91,48.86 0 top
R225  4.18,60.8 270 top
R226  6.97,64.61 270 top
R227  7.48,59.02 90 top
R228  31.1,63.85 0 top
R229  25.51,60.29 90 top
R230  25,82.14 270 top
R301  44.09,5.11 180 top
R302  73.56,5.11 180 top
R303  73.56,9.68 180 top
R304  78.89,5.11 0 top
R305  61.36,9.68 180 top
R306  61.36,5.11 0 top
R307  78.89,9.68 180 top
T  64.96,42.42 180 top
T201  31.1,70.96 0 top
TM101  75.32,82.36 180 top
TM201  20.75,31.02 0 top
U$1  [CE_10.00]  69.47,3.75 0 bottom
U$2  [CE_10.00]  51.71,83.21 270 bottom
U$3  [CE_10.00]  52.11,42.21 270 bottom

### Tracks (layer width: path | path; a pad name or v marks a point on that pad's centre or on a via)
+12V  (2 unrouted)
  Top 0.305: 40.03,9.68 D301.1 | 37.49,5.61 +.P$1
  Top 0.381: 71.06,29.97 R130.1 | 65.6,24.51 15.P$1 | 25,83.41 R230.1 | 30.47,88.87 15..P$1
  Top 0.406: 40.03,9.68 40.03,8.15 37.49,5.61
  Top 0.813: 65.6,24.51 71.06,29.97 | 30.47,88.87 25,83.41
  Bottom 0.406: 15_.TP 62.56,24.39 15.P$1 | 15_201.TP 33.5,88.99 15..P$1 | +12V.TP 36.96,5.47 +.P$1
+12V1
  Top 0.305: 32.41,5.61 BA.P$1
  Top 0.406: 32.41,5.61 38.25,12.47 66.44,12.47 66.83,12.09 | IC302.7 66.83,12.09 | R307.1 79.78,10.57 78.64,12.47 66.95,12.47 66.83,12.09
  Bottom 0.406: AUS.TP 31.96,5.47 BA.P$1
GND  (via drill 0.6)  (16 unrouted)
  Top 0.381: 65.47,33.91 64.96,33.91 D107.A | 91.89,46.61 91.51,46.61 | R102.1 v93.92,66.55 C101.2 | IC101.12 v81.47,67.18 | 73.73,66.93 73.73,67.56 v74.62,67.56 | 72.2,65.4 IC102.5 | 72.2,66.67 IC102.6 | 30.59,79.47 31.1,79.47 D207.A | 4.18,66.77 4.56,66.77 | R202.1 v2.14,46.83 C201.2 | IC201.12 v14.59,46.2 | 22.34,46.45 22.34,45.82 v21.45,45.82 | 23.86,47.98 IC202.5 | 23.86,46.7 IC202.6
  other vias: 89.6,45.59 67.38,34.8 72.97,37.72 85.28,56.64 6.46,67.79 28.69,78.58 23.1,75.66 10.78,56.74 58.32,5.11 76.1,2.82 88.8,12.22 87.27,5.11 70.76,2.82 49.92,11.11 52.92,7.11 27.02,12.16 0.98,13.52 2.76,13.52 9.11,22.66 9.11,25.58 4.87,13.52 4.87,15.3 3.87,16.5 1.87,15.5 9.11,24.26
  pour Bottom: 60.9,51.56 60.9,16 95.95,16 95.95,76.96 91.38,82.55 85.79,87.12 80.8,89.77 65.92,90.2 65.44,93.62 64.58,93.92 60.39,93.72 55.82,93.22 49.72,91.69 44.14,89.15 39.56,86.1 39.56,59.69 63.44,59.69 arc-90 67.5,55.62 67.5,55.12 arc-90 63.95,51.56
  pour Top: 96.31,76.78 92.06,81.9 85.26,87.4 80.16,90 66.06,90.2 65.8,93.66 64.3,93.86 57.16,93.6 48.39,91.16 39.9,86.33 39.8,59.35 63.78,59.25 67.66,55.8 65.76,52.1 63.76,51.6 60.86,51.4 60.78,16.1 61.92,16.13 96.08,16.13 96.21,16.64
  pour Bottom: 35.16,61.82 35.16,97.38 0.11,97.38 0.11,36.42 4.68,30.83 10.27,26.26 15.86,23.21 20.94,21.18 26.02,20.16 30.08,19.65 35.67,19.65 40.24,20.16 46.34,21.69 51.93,24.23 56.5,27.27 56.5,53.69 32.62,53.69 arc-90 28.56,57.75 28.56,58.26 arc-90 32.12,61.82
  pour Top: 0.06,35.99 2.46,32.8 9.66,26.4 21.46,20.8 31.47,19.4 41.48,20 49.63,22.65 56.83,27.41 56.48,53.93 32.06,53.6 30.76,61 35.36,62 35.38,97.08 34.15,97.25 -0.01,97.25 -0.14,96.74
  pour Top (rank 3): 96.34,13.74 10.63,13.74 10.63,5.61 14.74,5.36 17.41,1.42 96.08,1.17
  pour Bottom: 96.18,13.74 10.12,13.74 10.37,1.17 96.34,1.17
N$1
  Top 0.406: IC102.13 67.63,64.13 69.03,65.53 69.03,70.68 R118.1
N$2
  Top 0.406: R118.2 71.57,75.44 70.55,76.45 69.28,76.45 67.25,78.48 65.98,78.48 DIS101.10
N$3
  Top 0.406: IC102.12 67.63,65.4 68.01,65.78 68.01,72.96 R119.1
N$4
  Top 0.406: R119.2 67.76,75.44 66.23,76.96 63.69,76.96 62.68,77.98 62.68,79.25 DIS101.9
N$5
  Top 0.406: IC102.11 58.23,66.67 57.09,67.82 56.39,67.82 R120.1
N$6
  Top 0.406: R120.2 54.62,71.31 52.77,73.15 52.77,75.69 54.04,76.96 58.36,76.96 59.63,78.23 59.63,79.37 DIS101.8
N$7
  Top 0.406: IC102.10 65.96,67.82 58.36,67.82 57.85,68.32 R121.1
N$8
  Top 0.406: R121.2 57.66,71.31 55.31,73.4 55.31,73.91 DIS101.5
N$9
  Top 0.406: IC102.9 65.96,69.41 R122.1
N$10
  Top 0.406: R109.1 75.38,78.19 73.56,80 73.56,81.57 TM101.A
N$11
  Top 0.406: R122.2 60.46,71.31 57.85,73.66 57.85,73.91 DIS101.4
N$12
  Top 0.406: IC102.15 62.49,61.59 R123.1
N$13  (via drill 0.6)
  Top 0.406: R123.2 59.12,61.97 v58.61,62.48
  Bottom 0.406: v58.61,62.48 59.88,63.75 59.88,66.8 62.42,69.34 62.42,74.42 DIS101.2
N$14  (1 unrouted)
  Top 0.406: IC102.14 64.58,62.86 63.44,64.01 62.42,64.01
N$15  (via drill 0.6)
  Top 0.406: R124.2 58.87,64.51 v58.61,64.77
  Bottom 0.406: v58.61,64.77 58.61,67.31 59.88,68.58 59.88,74.42 DIS101.3
N$16  (via drill 0.6)
  Top 0.381: 70.68,24.51 A.P$1 70.55,25.91 | R115.2 70.55,45.97 73.47,45.97 75.12,44.32 D103.1 75.12,42.8 77.03,40.89 77.03,30.86 75.25,29.59 R111.2
  Top 0.406: v77.56,44 75.36,44 D103.1
  Top 0.61: R111.2 74.87,30.22 73.6,28.7 71.31,26.41 70.55,25.91
  Bottom 0.381: 70.55,24.51 A.P$1
  Bottom 0.406: A_.TP 76.56,43 v77.56,44
N$17  (via drill 0.6)
  Top 0.381: 75.63,24.51 B.P$1 75.76,24.64 | 80.2,29.72 R110.2 79.95,29.72 78.3,29.84 78.3,38.23 80.08,39.5 D102.2 D104.1 80.2,44.32 78.68,45.84 75.25,45.84 73.73,47.37 73.73,50.04 74.11,50.42 R114.2
  Top 0.406: v82.56,40 80.63,40 D102.2
  Top 0.61: 80.2,29.72 79.95,29.72 78.43,29.72 75.76,27.81 75.76,24.64
  Bottom 0.381: 75.51,24.51 B.P$1
  Bottom 0.406: B_.TP v82.56,40
N$18  (via drill 0.6)
  Top 0.381: 80.71,24.51 C.P$1 80.84,24.64 | D105.1 D101.2
  Top 0.406: D105.1 83.97,44.24 82.24,45.97 82.24,51.05 81.22,52.07 77.73,52.07 R112.2 | D101.2 83.25,37.55 v83.25,37.34
  Top 0.61: R108.2 85.28,29.08 80.84,24.64
  Bottom 0.406: 83.32,27.11 83.32,37.27 v83.25,37.34 84.56,38.65 C_.TP | C.P$1
  Bottom 0.61: 83.32,27.11 C.P$1
N$19
  Top 0.406: IC202.13 28.43,49.24 27.04,47.85 27.04,42.7 R218.1
N$21  (via drill 0.6)
  Top 0.406: R129.1 v70.55,56.64 | v77.66,59.18 78.17,59.18 78.68,59.17 IC101.1
  Bottom 0.406: v70.55,56.64 75.12,56.64 v77.66,59.18
N$22
  Top 0.381: Q101.1 66.49,42.67 66.49,44.7 67.25,45.46 T.1 67.12,45.59 67.12,50.42 67,50.54 | 67,50.54 65.98,49.53 R128.1 | 67,50.54 68.52,52.07 70.55,52.07 R129.2
N$23
  Top 0.406: R218.2 24.5,37.94 25.51,36.93 26.78,36.93 28.81,34.89 30.08,34.89 DIS201.10
N$24
  Top 0.406: IC202.12 28.43,47.98 28.05,47.59 28.05,40.42 R219.1
N$25
  Top 0.406: IC101.8 87.07,65.03 88.84,66.8 88.84,70.36 88.33,70.36 | 88.33,70.36 87.38,70.36 R106.2 | C101.1 90.93,70.23 R103.2 88.4,70.29 88.33,70.36
N$26  (via drill 0.6)
  Top 0.406: R104.1 v90.62,66.55 | v90.62,66.55 R103.1 | IC101.14 78.93,67.31 80.71,69.02 82.68,69.02 85.79,71.88 89.86,71.88 v90.87,72.9 92.58,72.9 R105.1 | v90.62,66.55 90.87,66.29
  Bottom 0.406: v90.87,72.9 v90.62,66.55
N$27
  Top 0.381: R107.2 88.84,35.18 | 88.84,35.18 R113.2 | 80.2,35.05 D102.1 80.33,35.05 85.16,35.05 D101.1 85.28,35.05 85.41,35.18 88.84,35.18
N$28
  Top 0.381: IC102.4 75.63,64.13 R117.1 75.76,64.26 76.78,64.13 79.06,62.35 80.2,62.35 | IC101.2 80.2,62.35 | 80.2,62.35 IC101.13
N$29
  Top 0.406: IC101.11 82.74,67.31 84.27,68.83 86.87,68.83 R106.1
N$30  (via drill 0.6)
  Top 0.381: IC101.10 84.01,66.29 v84.78,67.56
  Bottom 0.381: 79.06,73.78 v84.78,67.56
  Bottom 0.406: 79.06,73.78 78.93,73.91 78.93,77.59 75.76,80.77 75.76,84.87 TM101.S
N$31
  Top 0.406: R219.2 28.31,37.94 29.83,36.42 32.37,36.42 33.39,35.4 33.39,34.13 DIS201.9
N$32
  Top 0.381: R127.1 88.59,56.51 86.55,59.31 IC101.7
N$33
  Top 0.406: R113.1 88.84,41.91 87.32,46.48 84.27,46.48 83.76,46.99 83.76,52.83 82.74,53.85 IC101.4
N$34  (via drill 0.6)
  Top 0.381: R115.1 70.55,49.91 72.33,51.18 72.33,57.91 v69.54,58.81 | v69.79,64.39 69.79,66.8 71.31,67.94 IC102.7
  Bottom 0.381: v69.79,64.39 69.79,61.85 69.54,61.21 v69.54,58.81
N$35  (via drill 0.6)
  Top 0.406: R127.2 R116.1 85.35,51.49 v85.28,51.56
  Top 0.61: D103.2 D104.2 v80.2,51.05 | D105.2 v85.28,51.56
  Bottom 0.61: v80.2,51.05 84.78,51.05 v85.28,51.56
N$36
  Top 0.381: R112.1 77.66,55.37 74.87,58.16 74.87,59.69 72.97,61.59 IC102.2
N$37
  Top 0.381: R114.1 74.11,56.13 73.6,56.64 73.6,59.18 72.2,60.32 IC102.1
N$38
  Top 0.406: IC202.11 37.83,46.7 38.97,45.56 39.67,45.56 R220.1
N$39
  Top 0.406: R220.2 41.45,42.07 43.29,40.23 43.29,37.69 42.02,36.42 37.7,36.42 36.43,35.15 36.43,34 DIS201.8
N$40
  Top 0.406: IC202.10 30.11,45.56 37.7,45.56 38.21,45.05 R221.1
N$41
  Top 0.406: R221.2 38.4,42.07 40.75,39.97 40.75,39.47 DIS201.5
N$42
  Top 0.406: IC202.9 30.11,43.97 R222.1
N$43
  Top 0.406: R222.2 35.61,42.07 38.21,39.72 38.21,39.47 DIS201.4
N$44
  Top 0.406: IC202.15 33.58,51.78 R223.1
N$45  (via drill 0.6)
  Top 0.406: R223.2 36.94,51.4 v37.45,50.9
  Bottom 0.406: v37.45,50.9 36.18,49.63 36.18,46.58 33.64,44.04 33.64,38.96 DIS201.2
N$46  (1 unrouted)
  Top 0.406: IC202.14 31.48,50.52 32.62,49.37 33.64,49.37
N$47  (via drill 0.6)
  Top 0.406: R224.2 37.2,48.86 v37.45,48.61
  Bottom 0.406: v37.45,48.61 37.45,46.07 36.18,44.8 36.18,38.96 DIS201.3
N$48  (via drill 0.6)
  Top 0.381: 25.39,88.87 A..P$1 25.51,87.47 | R215.2 25.51,67.41 22.59,67.41 20.94,69.06 D203.1 20.94,70.58 19.04,72.49 19.04,82.52 20.81,83.79 R211.2
  Top 0.406: v18.5,69.38 20.7,69.38 D203.1
  Top 0.61: R211.2 21.19,83.15 22.46,84.68 24.75,86.96 25.51,87.47
  Bottom 0.381: 25.51,88.87 A..P$1
  Bottom 0.406: A_201.TP 19.5,70.38 v18.5,69.38
N$49  (via drill 0.6)
  Top 0.381: 20.43,88.87 B..P$1 20.31,88.74 | 15.86,83.66 R210.2 16.11,83.66 17.77,83.53 17.77,75.15 15.99,73.88 D202.2 D204.1 15.86,69.06 17.38,67.53 20.81,67.53 22.34,66.01 22.34,63.34 21.96,62.96 R214.2
  Top 0.406: v13.5,73.38 15.44,73.38 D202.2
  Top 0.61: 15.86,83.66 16.11,83.66 17.64,83.66 20.31,85.57 20.31,88.74
  Bottom 0.381: 20.56,88.87 B..P$1
  Bottom 0.406: B_201.TP v13.5,73.38
N$50  (via drill 0.6)
  Top 0.381: 15.35,88.87 C..P$1 15.23,88.74 | D205.1 D201.2
  Top 0.406: D205.1 12.09,69.14 13.83,67.41 13.83,62.33 14.84,61.31 18.33,61.31 R212.2 | D201.2 12.81,75.83 v12.81,76.04
  Top 0.61: R208.2 10.78,84.3 15.23,88.74
  Bottom 0.406: 12.75,86.27 12.75,76.1 v12.81,76.04 11.5,74.73 C_201.TP | C..P$1
  Bottom 0.61: 12.75,86.27 C..P$1
N$52  (via drill 0.6)
  Top 0.406: R229.1 v25.51,56.74 | v18.4,54.2 17.89,54.2 17.38,54.2 IC201.1
  Bottom 0.406: v25.51,56.74 20.94,56.74 v18.4,54.2
N$53
  Top 0.381: Q201.1 29.58,70.71 29.58,68.68 28.81,67.91 T201.1 28.94,67.79 28.94,62.96 29.07,62.83 | 29.07,62.83 30.08,63.85 R228.1 | 29.07,62.83 27.54,61.31 25.51,61.31 R229.2
N$54
  Top 0.381: R207.2 7.22,78.2 | 7.22,78.2 R213.2 | 15.86,78.33 D202.1 15.73,78.33 10.91,78.33 D201.1 10.78,78.33 10.65,78.2 7.22,78.2
N$55
  Top 0.381: IC202.4 20.43,49.24 R217.1 20.31,49.12 19.29,49.24 17,51.02 15.86,51.02 | IC201.2 15.86,51.02 | 15.86,51.02 IC201.13
N$56  (via drill 0.6)
  Top 0.406: R227.2 R216.1 10.71,61.88 v10.78,61.82
  Top 0.61: D203.2 D204.2 v15.86,62.33 | D205.2 v10.78,61.82
  Bottom 0.61: v15.86,62.33 11.29,62.33 v10.78,61.82
N$57
  Top 0.406: IC201.8 9,48.35 7.22,46.58 7.22,43.02 7.73,43.02 | 7.73,43.02 8.68,43.02 R206.2 | C201.1 5.13,43.15 R203.2 7.67,43.09 7.73,43.02
N$58  (via drill 0.6)
  Top 0.406: R204.1 v5.45,46.83 | v5.45,46.83 R203.1 | IC201.14 17.13,46.07 15.35,44.36 13.39,44.36 10.27,41.5 6.21,41.5 v5.19,40.48 3.48,40.48 R205.1 | v5.45,46.83 5.19,47.09
  Bottom 0.406: v5.19,40.48 v5.45,46.83
N$59  (via drill 0.6)
  Top 0.381: IC201.10 12.05,47.09 v11.29,45.82
  Bottom 0.381: 17,39.59 v11.29,45.82
  Bottom 0.406: 17,39.59 17.13,39.47 17.13,35.78 20.31,32.61 20.31,28.51 TM201.S
N$60
  Top 0.406: IC201.11 13.32,46.07 11.8,44.55 9.19,44.55 R206.1
N$61
  Top 0.381: R227.1 7.48,56.87 9.51,54.07 IC201.7
N$62
  Top 0.406: R213.1 7.22,71.47 8.75,66.9 11.8,66.9 12.3,66.39 12.3,60.55 13.32,59.53 IC201.4
N$63  (via drill 0.6)
  Top 0.381: R215.1 25.51,63.47 23.73,62.2 23.73,55.47 v26.53,54.56 | v26.27,48.99 26.27,46.58 24.75,45.44 IC202.7
  Bottom 0.381: v26.27,48.99 26.27,51.53 26.53,52.17 v26.53,54.56
N$64
  Top 0.381: R212.1 18.4,58.01 21.19,55.21 21.19,53.69 23.1,51.78 IC202.2
N$65
  Top 0.381: R214.1 21.96,57.25 22.46,56.74 22.46,54.2 23.86,53.05 IC202.1
N$66
  Top 0.406: R209.1 20.69,35.19 22.5,33.38 22.5,31.81 TM201.A
N$67
  Top 0.406: R302.2 71.27,6.88 67.21,6.88 66.95,6.63 IC302.2
N$68
  Top 0.305: 42.82,5.11 R301.2 | 22.25,5.11 BE.P$1
  Top 0.406: 42.82,5.11 40.99,1.87 24.48,1.87 22.25,5.11
  Bottom 0.406: BE.P$1 21.98,9.73 EIN.TP
N$69
  Top 0.406: R301.1 46.63,3.58 47.39,2.82 54.76,2.82 | 54.76,2.82 67.46,2.82 67.97,3.58 67.97,4.92 IC302.3 | C301.1 54.63,2.95 54.76,2.82
N$70
  Top 0.305: 45.87,10.44 D301.2
  Top 0.406: 45.87,10.44 47.65,10.44 IC301.3
N$76  (1 unrouted)
  Top 0.813: L1.2 74.9,91.57 74.39,92.08 74.39,94.28 74.1,94.58 | 74.1,94.58 C3.2 | C2.2 74.65,95.12 74.1,94.58
N$77  (1 unrouted)
  Top 0.813: C4.2 78.71,92.91 L2.2 79.39,93.09 C6.2 82.18,95.21 82.27,95.12 | C5.2 84.63,94.49
  Top 1.016: 82.27,95.12 C5.2
  Top 1.27: 84.63,94.49 C11.1 89.12,92.92 C12.1 89.97,95.46 90.14,95.76
N$78  (1 unrouted)
  Top 0.813: C8.2 6.07,22.4 PAD2.1 C9.2 | C4.1 76.93,93.67 76.08,93.26 | 76.08,93.26 L2.1 | C6.1 77.65,94.57 76.08,93.26
  Top 1.27: C8.2 8.1,20.63 8.48,19.61 8.48,14.79
  Bottom 1.27: L2.1 73.5,93.47 68.8,93.73 68.04,93.98 67.41,93.98
N$79
  Top 0.813: C10.1 1.24,19.85 PAD4.1
  Top 1.27: PAD4.1 1.75,18.85 1.87,18.73 C7.1
N$80  (2 unrouted)
  Top 0.813: L1.1 72.18,92.15 C1.1 70.33,95.38 C3.1 | PAD1.1 3.8,24.57 | 3.8,24.57 3.67,22.77 4.03,22.41 4.03,20.72 C8.1 | C10.2 3.8,24.57
  Top 1.27: C8.1 3.94,20.34 6.45,17.58 6.45,14.79 | 66.77,95.5 69.01,95.5
N$81  (1 unrouted)
  Top 1.27: C12.2 93.61,94.57 92.43,95.76 93.95,95.38 PAD5.1
N$82
  Top 0.813: 75.92,93.09 76.68,92.33
N$83
  Top 0.813: 79.47,93.09 78.71,92.33
N$84
  Top 0.813: 78.71,93.09 78.96,93.09 79.47,93.6
N$85
  Top 0.813: 75.15,91.57 75.15,91.82 74.65,92.33
N$86
  Top 0.813: 72.11,91.57 72.61,92.08
N$87
  Top 0.813: 1.87,24.57 2.76,24.57 3.27,24.06
N$92
  Top 0.305: 65.43,5.11 IC302.1
  Top 0.406: R303.2 71.27,7.65 65.94,7.65 65.43,6.88 65.43,5.11
N$96
  Top 0.305: 77.62,5.11 R304.1 78.13,4.6 | 74.57,9.17 R303.1 | 83.21,4.6 C302.1
  Top 0.406: 77.62,5.11 77.62,6.12 74.57,9.17 | 83.21,4.6 82.45,4.6 81.68,3.33 78.89,3.33 78.13,4.6
N$97
  Top 0.305: 77.87,9.68 R307.2 | 84.22,9.17 D302.2
  Top 0.406: 77.87,9.68 76.86,11.46 69.49,11.46 IC302.5 | R307.2 78.13,9.3 78.13,7.9 78.38,7.65 | D302.2 83.72,9.42 81.68,7.65 78.38,7.65 | 78.38,7.65 79.65,6.38 79.65,4.98 R304.2
N$101
  Top 0.305: 62.38,5.11 R306.2 | 62.38,9.68 R305.1 | 67.97,10.19 IC302.6
  Top 0.406: 62.38,9.68 62.38,8.41 | 62.38,8.41 62.38,5.11 | 67.97,10.19 67.97,8.92 67.46,8.41 62.38,8.41
VCC  (via drill 0.6)  (2 unrouted)
  Top 0.406: 93.09,75.44 90.11,75.44 87.82,73.15 75.44,73.15 R109.2 | 93.09,75.44 93.92,75.44 95.44,73.91 95.44,60.2 93.16,57.91 92.84,57.72 R101.2 | R105.2 93.09,75.44 | 2.97,37.94 5.95,37.94 8.24,40.23 20.62,40.23 R209.2 | 2.97,37.94 2.14,37.94 0.62,39.47 0.62,53.18 2.91,55.47 3.23,55.66 R201.2 | R205.2 2.97,37.94 | IC301.1 51.44,9.95 | 51.44,9.95 51.44,10.59 51.46,10.69 51.97,11.2 54.76,11.2 | 54.76,11.2 60.35,11.2 | 60.35,10.19 R305.2 60.48,11.07 60.35,11.2 | 60.35,11.2 64.6,11.2 IC302.8 | C303.1 54.63,11.07 54.76,11.2 | v52.96,9.75 51.64,9.75 51.44,9.95
  Top 0.6: R130.2 C102.1 | 82.24,31.24 82.36,31.62 85.28,31.62 R108.1 85.41,31.37 88.84,31.37 R107.1 89.09,31.49 89.48,31.49 90.87,32.26 90.87,43.43 93.92,46.48 93.92,52.45 93.79,52.58 92.14,53.72 R125.2 R101.2 | R117.2 75.25,62.48 74.87,62.86 IC102.3 71.82,62.74 70.17,62.74 67.76,60.32 67.5,60.32 IC102.16 | R230.2 C203.1 | 13.83,82.14 13.7,81.76 10.78,81.76 R208.1 10.65,82.01 7.22,82.01 R207.1 6.97,81.88 6.59,81.88 5.19,81.12 5.19,69.95 2.14,66.9 2.14,60.93 2.27,60.8 3.92,59.66 R225.2 R201.2 | R217.2 20.81,50.9 21.19,50.52 IC202.3 24.24,50.64 25.89,50.64 28.31,53.05 28.56,53.05 IC202.16
  Top 0.61: R101.2 91.06,57.72 90.11,58.67 90.11,60.7 88.08,62.23 82.24,62.23 81.47,61.34 IC101.3 81.47,57.27 80.84,56.64 78.17,56.64 76.14,58.61 76.14,60.96 75.7,61.4 75.7,62.23 | R201.2 5,55.66 5.95,54.71 5.95,52.67 7.99,51.15 13.83,51.15 14.59,52.04 IC201.3 14.59,56.1 15.23,56.74 17.89,56.74 19.92,54.77 19.92,52.42 20.37,51.98 20.37,51.15
  Top 0.813: 75.12,33.27 70.91,33.27 R130.2 70.4,32.76 68.52,32.76 67.5,31.75 67.5,29.21 66.99,28.69 D107.C | 75.12,33.27 D106.1 | R111.1 75.12,33.27 | R110.1 81.79,31.68 82.24,31.24 82.24,28.7 81.47,28.19 79.7,28.19 78.05,27.43 78.05,19.56 66.49,19.56 65.22,18.29 62.68,18.29 61.92,19.05 61.92,26.15 | 75.7,62.23 R117.2 | D107.C | v67.76,58.67 67.76,60.07 67.5,60.32 | 61.92,26.16 62.42,26.67 v62.42,28.7 v62.43,28.69 D107.C | 20.94,80.11 25.16,80.11 R230.2 25.66,80.61 27.54,80.61 28.56,81.63 28.56,84.17 29.08,84.69 D207.C | 20.94,80.11 D206.1 | R211.1 20.94,80.11 | R210.1 14.27,81.7 13.83,82.14 13.83,84.68 14.59,85.19 16.37,85.19 18.02,85.95 18.02,93.82 29.58,93.82 30.85,95.09 33.39,95.09 34.15,94.33 34.15,87.23 | 20.37,51.15 R217.2 | D207.C 31.1,84.68 | v28.31,54.71 28.31,53.31 28.56,53.05 | 34.15,87.22 33.64,86.71 v33.64,84.68 33.63,84.69 D207.C
  Bottom 0.406: 6V.TP v52.96,9.75
  Bottom 0.813: v62.42,28.7 62.42,46.73 68.27,52.58 68.27,58.16 v67.76,58.67 | v33.64,84.68 33.64,66.64 27.8,60.8 27.8,55.21 v28.31,54.71
VREF_LOGIC  (1 unrouted)
  Top 0.381: R126.2 R125.1 | IC101.6 | 83.89,59.31 IC101.5 | R226.2 R225.1 | IC201.6 | 12.18,54.07 IC201.5
  Top 0.406: R125.1 91.83,51.69 91,51.69 90.11,52.58 90.11,57.02 88.21,58.93 88.21,60.58 87.44,61.26 85.28,61.26 85.28,61.09 | 85.28,61.09 IC101.6 | IC101.5 84.01,60.7 84.4,61.09 85.28,61.09 | R225.1 4.24,61.69 5.07,61.69 5.95,60.8 5.95,56.36 7.86,54.45 7.86,52.8 8.62,52.12 10.78,52.12 10.78,52.29 | 10.78,52.29 IC201.6 | IC201.5 12.05,52.67 11.67,52.29 10.78,52.29
VREF_OSZ  (1 unrouted)
  Top 0.406: IC101.9 85.28,63.75 85.92,63.24 90.81,63.24 R104.2 90.87,62.99 92.02,61.85 | 92.02,61.85 92.14,61.72 92.14,59.88 R101.1 | R102.2 93.48,63.31 92.02,61.85 | IC201.9 10.78,49.63 10.15,50.13 5.26,50.13 R204.2 5.19,50.39 4.05,51.53 | 4.05,51.53 3.92,51.66 3.92,53.5 R201.1 | R202.2 2.59,50.07 4.05,51.53
ZUEND_EIN
  Top 1: 63.12,46.54 62.68,46.1 62.68,45.59 T.3 | 63.12,46.54 63.95,47.37 63.95,49.53 R128.2 | 63.12,46.54 63.44,46.23 63.44,42.67 Q101.3 63.19,42.16 62.3,41.27 62.3,37.84 63.44,36.7 66.74,36.7 69.03,39.24 70.04,40.38 74.24,40.38 75.12,39.5 D106.2
ZUEND_EIN1
  Top 1: 32.94,66.83 33.39,67.28 33.39,67.79 T201.3 | 32.94,66.83 32.12,66.01 32.12,63.85 R228.2 | 32.94,66.83 32.62,67.15 32.62,70.71 Q201.3 32.88,71.22 33.77,72.1 33.77,75.53 32.62,76.68 29.32,76.68 27.04,74.14 26.02,72.99 21.83,72.99 20.94,73.88 D206.2
ZUENDPLUS_OUT  (via drill 0.6)
  Top 0.406: T.2 Q101.2 64.96,39.88
  Top 1.016: v68.14,41.4 67,39.88 64.96,39.88
  Bottom 0.406: LEER_.TP 68.74,42 v68.14,41.4
  Bottom 1.016: LEER.P$1 85.59,22.4 83.76,20.06 69.79,20.06 68.14,21.33 68.14,27.94 69.28,29.21 69.28,38.61 68.14,39.75 v68.14,41.4
ZUENDPLUS_OUT1  (via drill 0.6)
  Top 0.406: T201.2 Q201.2 31.1,73.5
  Top 1.016: v27.93,71.98 29.07,73.5 31.1,73.5
  Bottom 0.406: LEER_201.TP 27.33,71.38 v27.93,71.98
  Bottom 1.016: LEER..P$1 10.48,90.98 12.3,93.31 26.27,93.31 27.93,92.04 27.93,85.44 26.78,84.17 26.78,74.77 27.93,73.63 v27.93,71.98
(copper drawn outside any net)
  shapes: Bottom area x3, Bottom circle x1, Top area x5, Top circle x1

### Text on the board
bPlace: QC | QC | QC